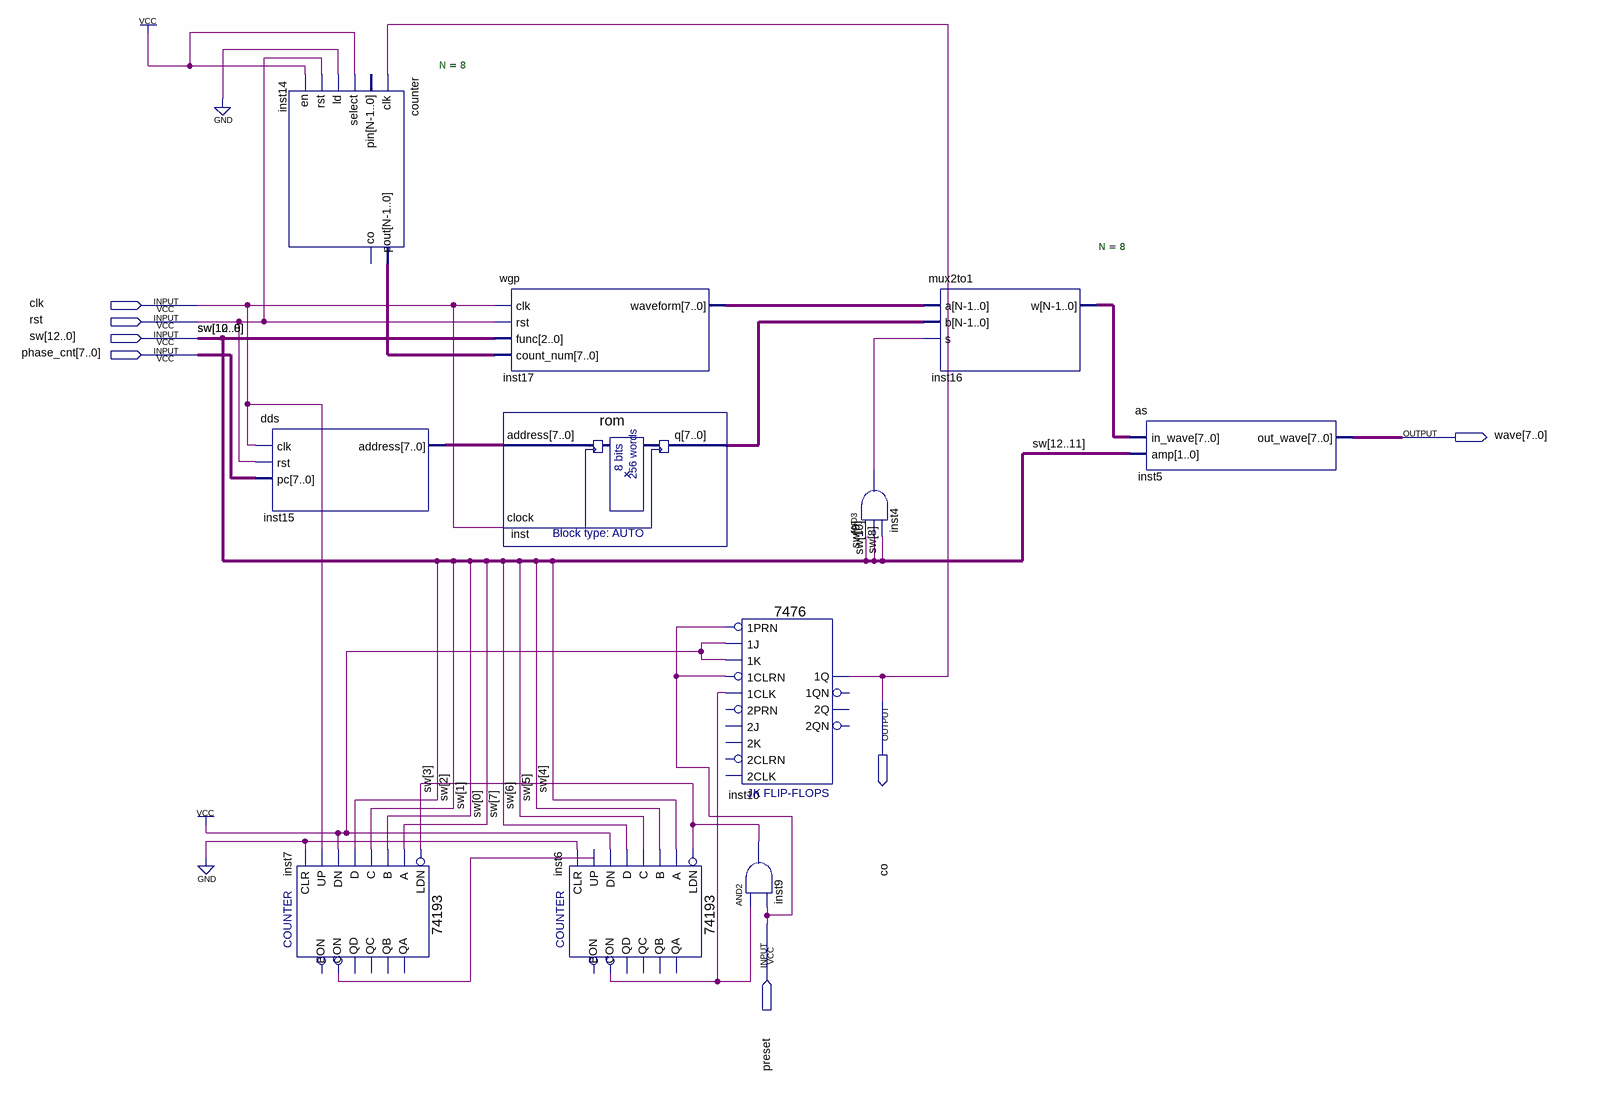
[diagram p0: schematic sheet]
// Quartus schematic amps.bdf as structural Verilog: 11 symbols, 7 pins
module amps (
  input  clk,
  input  rst,
  input  [12:0] sw,
  input  [7:0] phase_cnt,
  input  preset,
  output [7:0] wave,
  output co
);

  wire inst4_out, inst6_con, inst7_con, inst9_out;
  wire [7:0] inst14_pout, inst15_address, inst16_w, inst17_waveform, inst_q;

  dds inst15 (.clk(clk), .rst(rst), .pc(phase_cnt), .address(inst15_address));
  counter #(.N(8)) inst14 (
    .clk(co), .select(1'b1), .ld(1'b0), .rst(rst), .en(1'b1), .pout(inst14_pout));  // open: pin, co
  \74193  inst7 (
    .D(sw[3]), .C(sw[2]), .B(sw[1]), .A(sw[0]), .CLR(1'b0), .UP(clk), .DN(1'b1), .LDN(inst9_out),
    .CON(inst7_con));  // open: QB, QA, QD, QC, BON
  wgp inst17 (.clk(clk), .rst(rst), .func(sw[10:8]), .count_num(inst14_pout), .waveform(inst17_waveform));
  rom inst (.address(inst15_address), .clock(clk), .q(inst_q));
  \74193  inst6 (
    .D(sw[7]), .C(sw[6]), .B(sw[5]), .A(sw[4]), .CLR(1'b0), .UP(inst7_con), .DN(1'b1), .LDN(inst9_out),
    .CON(inst6_con));  // open: QB, QA, QD, QC, BON
  \7476  inst10 (
    .\1J (1'b1), .\1K (1'b1), .\1PRN (preset), .\1CLK (inst6_con), .\1CLRN (preset), .\1Q (co));  // open: 2PRN, 2J, 2K, 2CLRN, 2CLK, 2QN, 2Q, 1QN
  and inst9 (inst9_out, inst6_con, preset);
  and inst4 (inst4_out, sw[9], sw[10], sw[8]);
  mux2to1 #(.N(8)) inst16 (.a(inst17_waveform), .b(inst_q), .s(inst4_out), .w(inst16_w));
  as inst5 (.in_wave(inst16_w), .amp(sw[12:11]), .out_wave(wave));
endmodule
